# EAGLE design M113C (EAGLE 6.6.0)
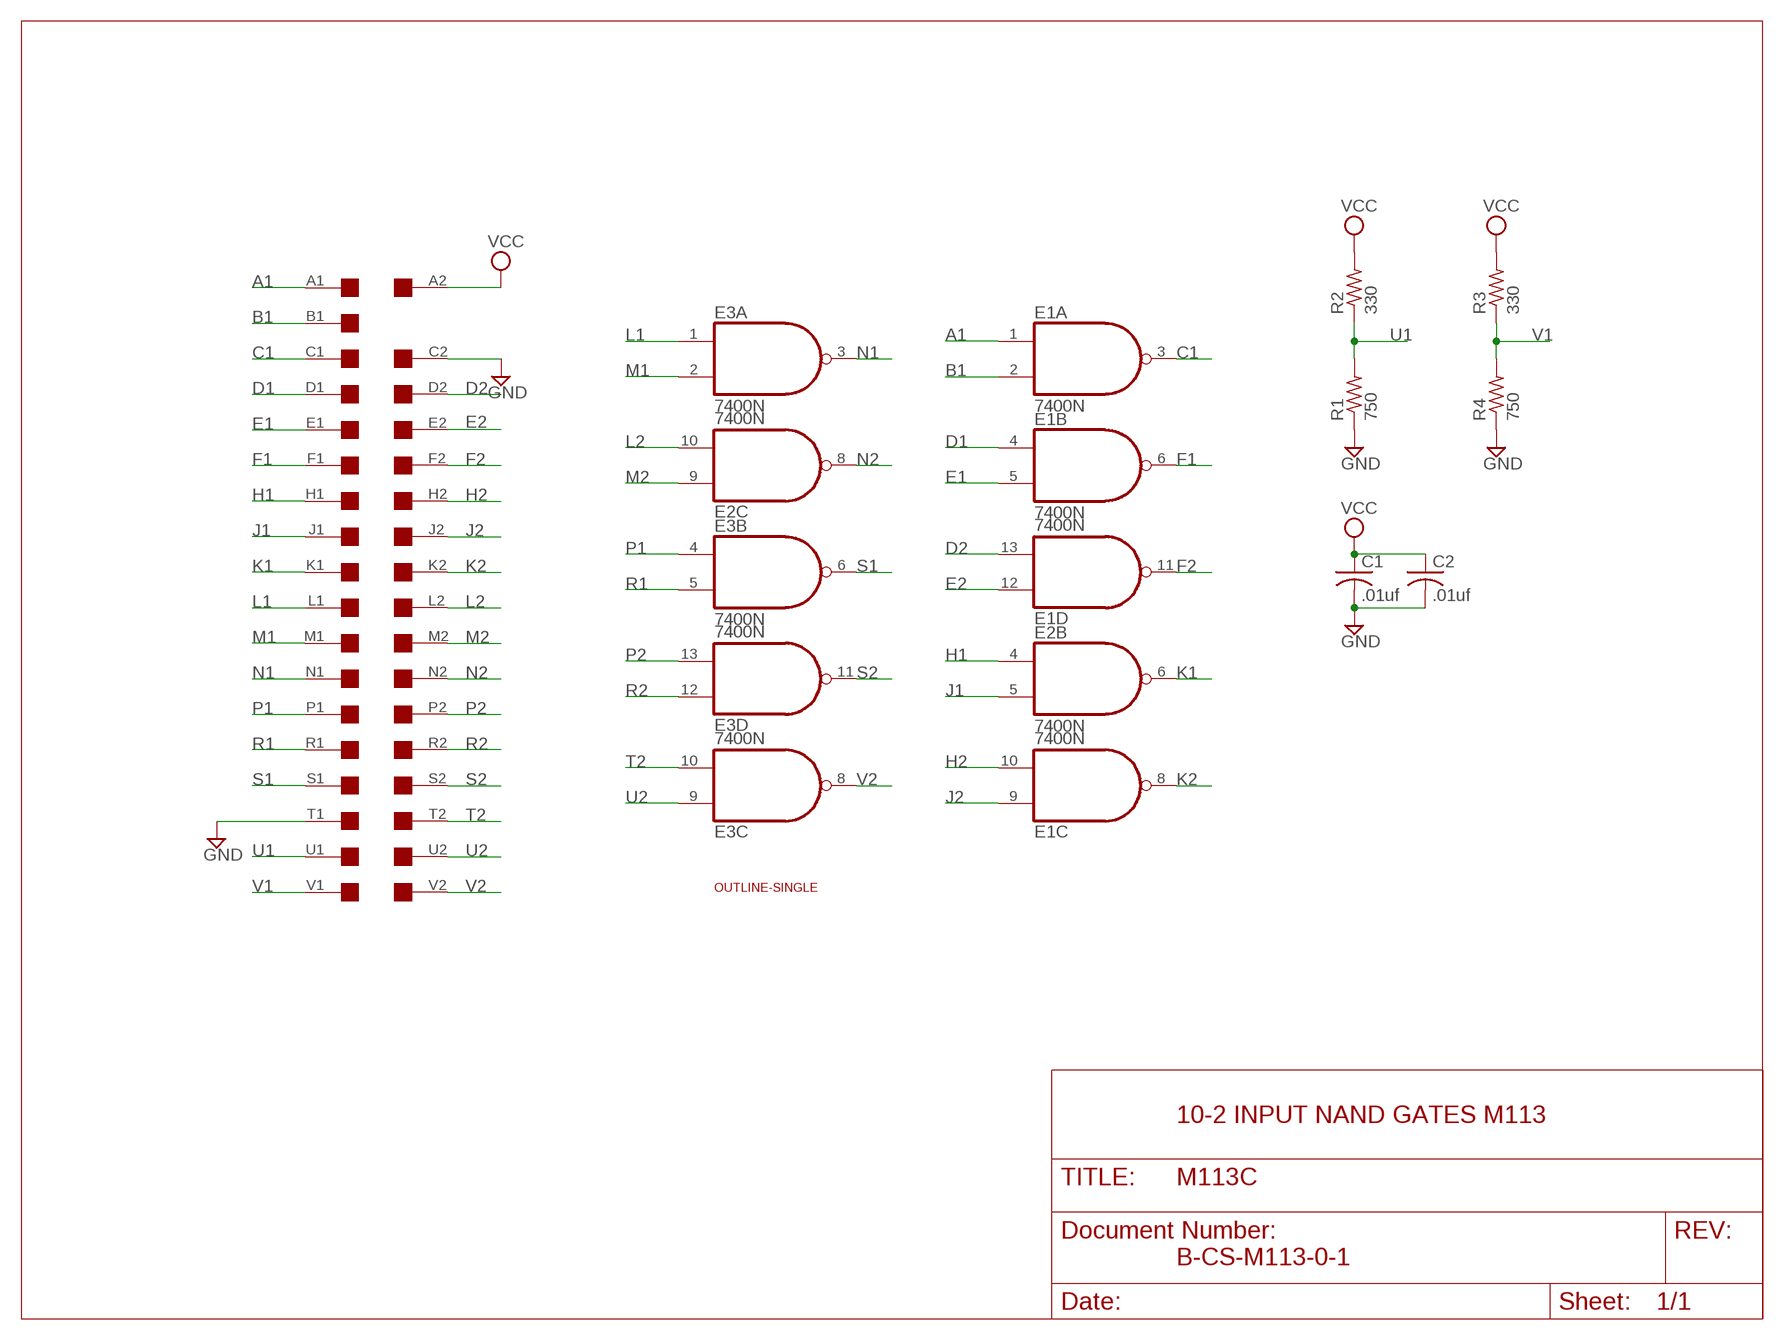
[diagram p0: schematic, sheet 1]

## Parts
C1  .01uf  C-US050-025X075  [C050-025X075]
C2  .01uf  C-US050-025X075  [C050-025X075]
E1  7400N  [DIL14]
E2  7400N  [DIL14]
E3  7400N  [DIL14]
R1  750  R-US_0207/10  [0207/10]
R2  330  R-US_0207/10  [0207/10]
R3  330  R-US_0207/10  [0207/10]
R4  750  R-US_0207/10  [0207/10]
U$1  SINGLE  [EDGE-CON2]
U$2  OUTLINE-SINGLE  [SINGLE]

## Nets
A1: E1.1(A:I0) U$1.A1
B1: E1.2(A:I1) U$1.B1
C1: E1.3(A:O) U$1.C1
D1: E1.4(B:I0) U$1.D1
D2: E1.13(D:I1) U$1.D2
E1: E1.5(B:I1) U$1.E1
E2: E1.12(D:I0) U$1.E2
F1: E1.6(B:O) U$1.F1
F2: E1.11(D:O) U$1.F2
GND [Supply]: C1.2 C2.2 R1.1 R4.1 U$1.C2 U$1.T1
H1: E2.4(B:I0) U$1.H1
H2: E1.10(C:I1) U$1.H2
J1: E2.5(B:I1) U$1.J1
J2: E1.9(C:I0) U$1.J2
K1: E2.6(B:O) U$1.K1
K2: E1.8(C:O) U$1.K2
L1: E3.1(A:I0) U$1.L1
L2: E2.10(C:I1) U$1.L2
M1: E3.2(A:I1) U$1.M1
M2: E2.9(C:I0) U$1.M2
N1: E3.3(A:O) U$1.N1
N2: E2.8(C:O) U$1.N2
P1: E3.4(B:I0) U$1.P1
P2: E3.13(D:I1) U$1.P2
R1: E3.5(B:I1) U$1.R1
R2: E3.12(D:I0) U$1.R2
S1: E3.6(B:O) U$1.S1
S2: E3.11(D:O) U$1.S2
T2: E3.10(C:I1) U$1.T2
U1: R1.2 R2.1 U$1.U1
U2: E3.9(C:I0) U$1.U2
V1: R3.1 R4.2 U$1.V1
V2: E3.8(C:O) U$1.V2
VCC [Supply]: C1.1 C2.1 R2.2 R3.2 U$1.A2
Unconnected: E2.1(A:I0) E2.2(A:I1) E2.3(A:O) E2.11(D:O) E2.12(D:I0) E2.13(D:I1) U$1.B2

## Notes on the sheet
- 10-2 INPUT NAND GATES M113
- B-CS-M113-0-1

## Power pins joined to a net without a drawn wire
GND: E1.7(P:GND) E2.7(P:GND) E3.7(P:GND)
VCC: E1.14(P:VCC) E2.14(P:VCC) E3.14(P:VCC)

## Library data of the parts
C1 C2 = rcl:C-US: CAPACITOR, American symbol
E1-E3 = 74xx-us:74*00: Quad 2-input NAND gate
R1-R4 = rcl:R-US_: RESISTOR, American symbol
U$1 = dec-con:SINGLE: Single-Height DEC board
U$2 = dec-con:OUTLINE-*: Board outlines for DEC boards.

## Net classes
1 Supply: width 0.813 mm

## Board
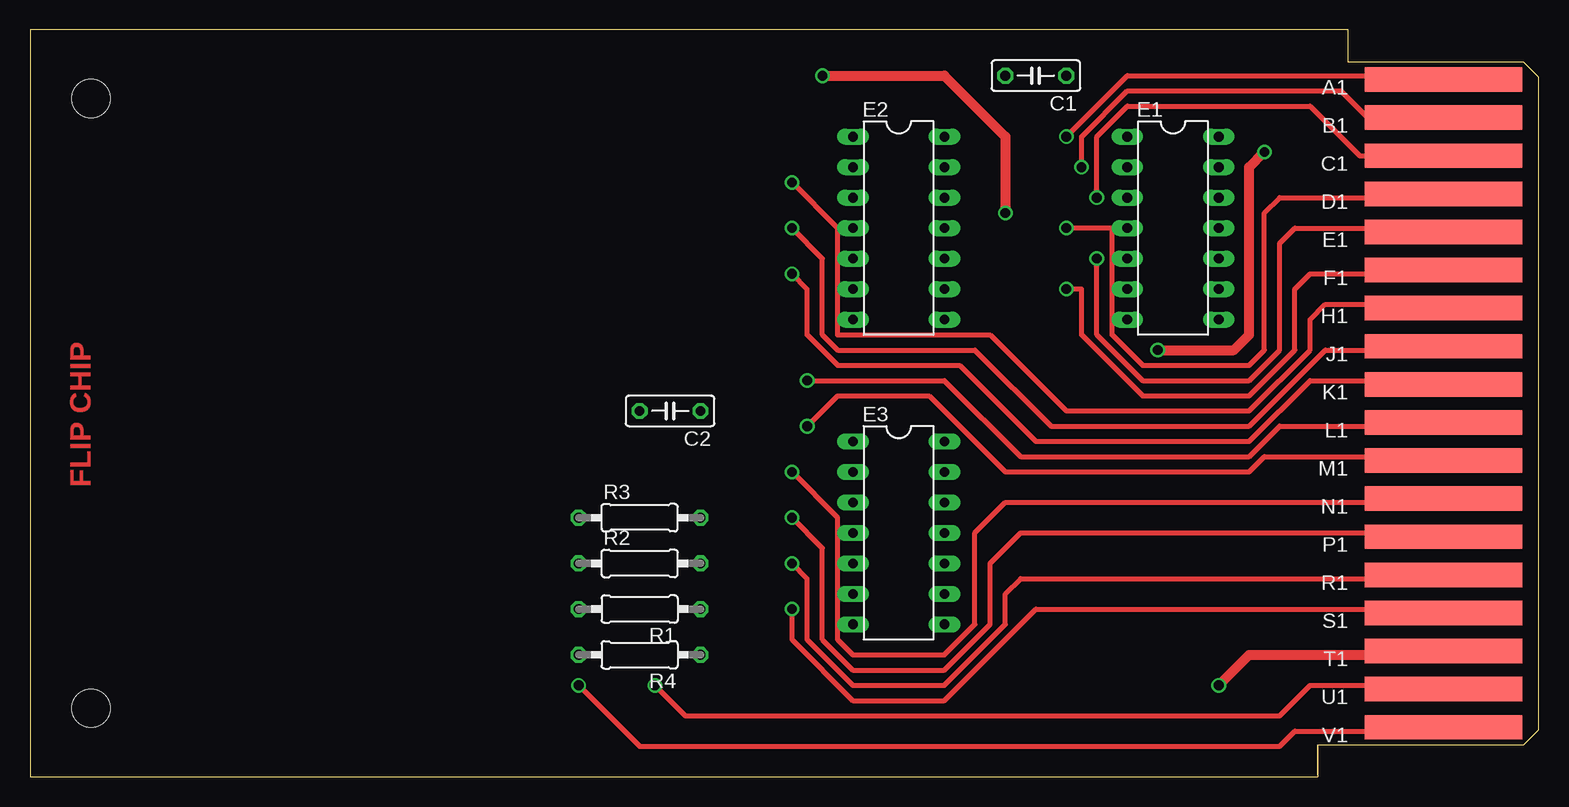
[diagram p1: board, top side]
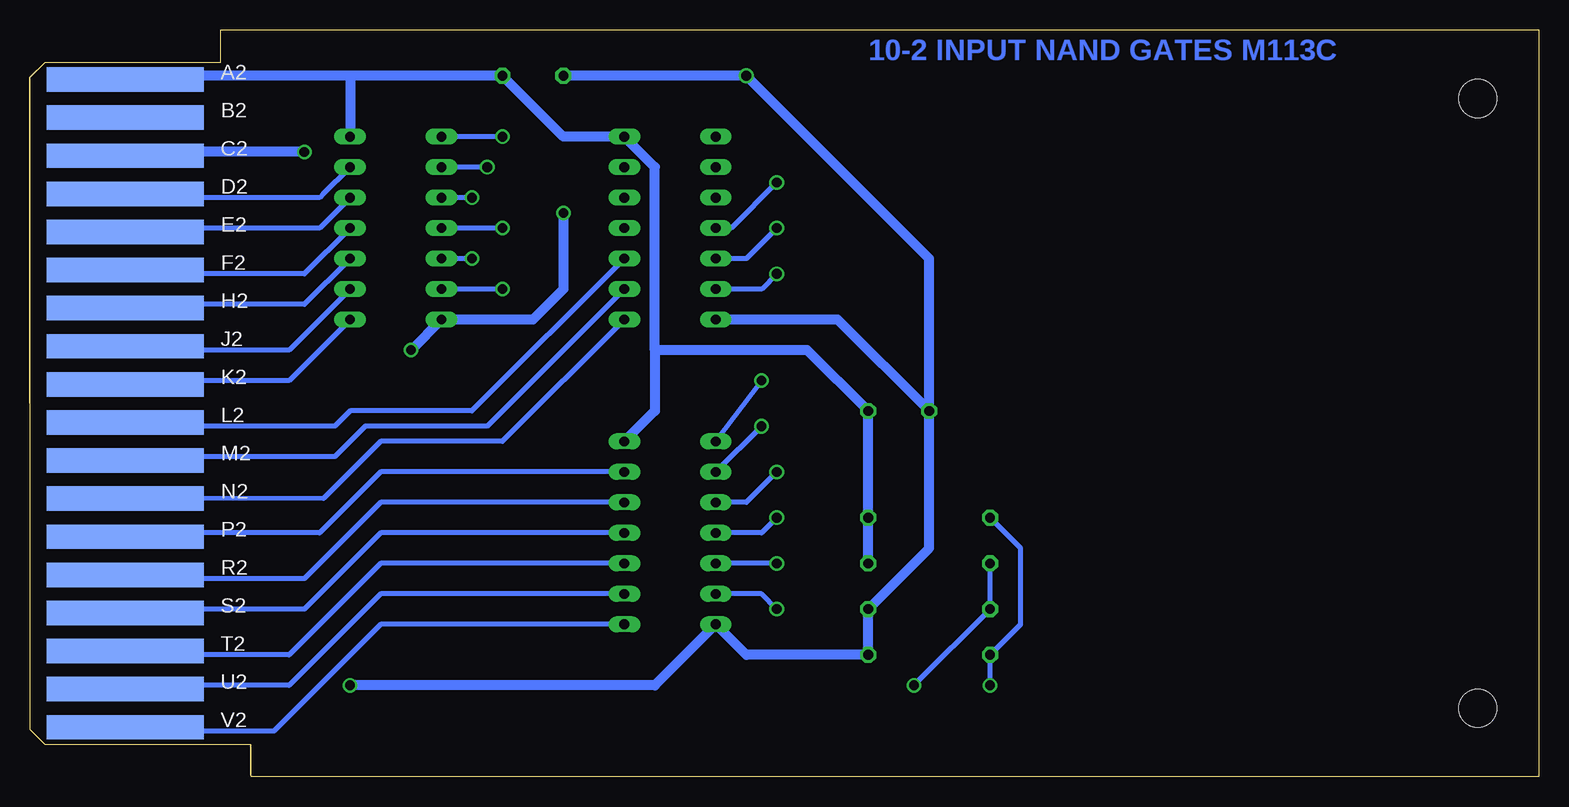
[diagram p2: board, bottom side, seen from below]

Size 125.73 x 62.23 mm. Coordinates in mm from the lower left corner, seen from the top.
Copper layers (1+16): Top 0.035mm / dielectric 1.5mm / Bottom 0.035mm
Design rules "16mils": minimum track width 16mil, minimum drill 32mil, track to track 15mil, track to pad 10mil, pad to pad 10mil, via to via 10mil, smd to smd 10mil, copper to edge 13mil, drill to drill 10mil, minimum pad ring 10mil, minimum via ring 8mil, stop-mask expansion 0mil, vias tented up to drill 0mil, thermal gap 10mil

### Footprints (pad centres in the part's own frame; a part is rotated, then mirrored left to right if it is on the bottom)
C050-025X075 = drill 0.813 octagon: 1 -2.54,0; 2 2.54,0
DIL14 = drill 0.813 long: 1 -7.62,-3.81; 2 -5.08,-3.81; 3 -2.54,-3.81; 4 0,-3.81; 5 2.54,-3.81; 6 5.08,-3.81; 7 7.62,-3.81; 8 7.62,3.81; 9 5.08,3.81; 10 2.54,3.81; 11 0,3.81; 12 -2.54,3.81; 13 -5.08,3.81; 14 -7.62,3.81
0207/10 = drill 0.813 octagon: 1 -5.08,0; 2 5.08,0
EDGE-CON2 = smd 13.106 x 2.032: A1 7.938,4.128; B1 7.938,7.303; C1 7.938,10.477; D1 7.938,13.652; E1 7.938,16.828; F1 7.938,20.003; H1 7.938,23.177; J1 7.938,26.352; K1 7.938,29.527; L1 7.938,32.703; M1 7.938,35.877; N1 7.938,39.053; P1 7.938,42.227; R1 7.938,45.403; S1 7.938,48.578; T1 7.938,51.752; U1 7.938,54.928; V1 7.938,58.102 | smd 13.106 x 2.032 bottom: A2 7.938,4.128; B2 7.938,7.303; C2 7.938,10.477; D2 7.938,13.652; E2 7.938,16.828; F2 7.938,20.003; H2 7.938,23.177; J2 7.938,26.352; K2 7.938,29.527; L2 7.938,32.703; M2 7.938,35.877; N2 7.938,39.053; P2 7.938,42.227; R2 7.938,45.403; S2 7.938,48.578; T2 7.938,51.752; U2 7.938,54.928; V2 7.938,58.102
SINGLE = hole 3.175: 120.65,56.515; 120.65,5.715

### Placement (x,y rotation side)
C1  83.82,58.42 180 top
C2  53.34,30.48 180 top
E1  95.25,45.72 270 top
E2  72.39,45.72 270 top
E3  72.39,20.32 270 top
R1  50.8,13.97 180 top
R2  50.8,17.78 0 top
R3  50.8,21.59 0 top
R4  50.8,10.16 180 top
U$1  125.73,62.23 180 top
U$2  125.73,62.23 180 top

### Tracks (layer width: path | path; a pad name or v marks a point on that pad's centre or on a via)
A1  (via drill 0.81)
  Top 0.406: U$1.A1 112.16,58.02 111.76,58.42 91.44,58.42 v86.36,53.34
  Bottom 0.406: v86.36,53.34 E1.1
B1  (via drill 0.81)
  Top 0.406: U$1.B1 112.74,54.9 111.76,54.61 109.22,57.15 91.44,57.15 87.63,53.34 v87.63,50.8
  Bottom 0.406: v87.63,50.8 E1.2
C1  (via drill 0.81)
  Top 0.406: U$1.C1 110.82,51.74 106.68,55.88 91.44,55.88 88.9,53.34 v88.9,48.26
  Bottom 0.406: v88.9,48.26 E1.3
D1  (via drill 0.81)
  Top 0.406: U$1.D1 112.06,48.56 111.76,48.26 104.14,48.26 102.87,46.99 102.87,35.56 101.6,34.29 92.71,34.29 90.17,36.83 90.17,45.72 v86.36,45.72
  Bottom 0.406: v86.36,45.72 E1.4
D2
  Bottom 0.406: U$1.D2 112.06,48.56 111.76,48.26 101.6,48.26 101.3,48.56 E1.13
E1  (via drill 0.81)
  Top 0.406: U$1.E1 112.09,45.39 111.76,45.72 105.41,45.72 104.14,44.45 104.14,35.56 101.6,33.02 92.71,33.02 88.9,36.83 v88.9,43.18
  Bottom 0.406: v88.9,43.18 E1.5
E2
  Bottom 0.406: U$1.E2 112.09,45.39 111.76,45.72 101.6,45.72 E1.12
F1  (via drill 0.81)
  Top 0.406: U$1.F1 112.04,42.19 111.76,41.91 106.68,41.91 105.41,40.64 105.41,35.56 101.6,31.75 92.71,31.75 87.63,36.83 87.63,40.64 v86.36,40.64
  Bottom 0.406: v86.36,40.64 E1.6
F2
  Bottom 0.406: U$1.F2 112.04,42.19 111.76,41.91 102.87,41.91 E1.11
GND  (via drill 0.81)
  Top 0.813: v102.87,52.07 101.6,50.8 101.6,36.83 100.33,35.56 v93.98,35.56 | v66.04,58.42 76.2,58.42 81.28,53.34 v81.28,46.99 | U$1.T1 112.09,10.49 111.76,10.16 101.6,10.16 v99.06,7.62
  Bottom 0.813: U$1.C2 112.09,51.74 111.76,52.07 v102.87,52.07 | v93.98,35.56 E1.7 83.82,38.1 81.28,40.64 v81.28,46.99 | C1.2 v66.04,58.42 50.8,43.18 C2.2 | C2.2 58.42,38.1 E2.7 | C2.2 50.8,19.05 R1.1 R4.1 66.04,10.16 E3.7 73.66,7.62 v99.06,7.62
H1  (via drill 0.81)
  Top 0.406: U$1.H1 112.09,39.04 111.76,39.37 107.95,39.37 106.68,38.1 106.68,35.56 101.6,30.48 86.36,30.48 80.01,36.83 67.31,36.83 67.31,45.72 v63.5,49.53
  Bottom 0.406: E2.4 67.31,45.72 v63.5,49.53
H2
  Bottom 0.406: U$1.H2 112.09,39.04 111.76,39.37 102.87,39.37 E1.10
J1  (via drill 0.81)
  Top 0.406: U$1.J1 112.09,35.89 111.76,35.56 107.95,35.56 101.6,29.21 85.09,29.21 78.74,35.56 67.31,35.56 66.04,36.83 66.04,43.18 v63.5,45.72
  Bottom 0.406: E2.5 66.04,43.18 v63.5,45.72
J2
  Bottom 0.406: U$1.J2 112.09,35.89 111.76,35.56 104.14,35.56 103.81,35.89 E1.9
K1  (via drill 0.81)
  Top 0.406: U$1.K1 112.06,32.72 111.76,33.02 106.68,33.02 101.6,27.94 83.82,27.94 77.47,34.29 67.31,34.29 64.77,36.83 64.77,40.64 v63.5,41.91
  Bottom 0.406: E2.6 64.77,40.64 v63.5,41.91
K2
  Bottom 0.406: U$1.K2 112.06,32.72 111.76,33.02 104.14,33.02 E1.8
L1  (via drill 0.81)
  Top 0.406: v64.77,33.02 76.2,33.02 82.55,26.67 101.6,26.67 104.14,29.21 111.76,29.21 112.09,29.54 U$1.L1
  Bottom 0.406: E3.1 v64.77,33.02
L2
  Bottom 0.406: E2.10 88.9,30.48 99.06,30.48 100.33,29.21 111.76,29.21 112.09,29.54 U$1.L2
M1  (via drill 0.81)
  Top 0.406: v64.77,29.21 67.31,31.75 74.93,31.75 81.28,25.4 101.6,25.4 102.87,26.67 111.76,26.67 112.09,26.34 U$1.M1
  Bottom 0.406: v64.77,29.21 E3.2
M2
  Bottom 0.406: E2.9 87.63,29.21 97.79,29.21 100.33,26.67 111.76,26.67 112.09,26.34 U$1.M2
N1  (via drill 0.81)
  Top 0.406: U$1.N1 112.09,23.19 111.76,22.86 81.28,22.86 78.74,20.32 78.74,12.7 76.2,10.16 68.58,10.16 67.31,11.43 67.31,21.59 v63.5,25.4
  Bottom 0.406: E3.3 66.04,22.86 v63.5,25.4
N2
  Bottom 0.406: U$1.N2 101.27,23.19 96.52,27.94 86.36,27.94 E2.8
P1  (via drill 0.81)
  Top 0.406: U$1.P1 112.09,19.99 111.76,20.32 82.55,20.32 80.01,17.78 80.01,12.7 76.2,8.89 68.58,8.89 66.04,11.43 66.04,19.05 v63.5,21.59
  Bottom 0.406: E3.4 64.77,20.32 v63.5,21.59
P2
  Bottom 0.406: U$1.P2 112.09,19.99 111.76,20.32 101.6,20.32 96.52,25.4 E3.13
R1  (via drill 0.81)
  Top 0.406: U$1.R1 112.09,16.84 111.76,16.51 82.55,16.51 81.28,15.24 81.28,12.7 76.2,7.62 68.58,7.62 64.77,11.43 64.77,16.51 v63.5,17.78
  Bottom 0.406: v63.5,17.78 E3.5
R2
  Bottom 0.406: U$1.R2 112.09,16.84 111.76,16.51 102.87,16.51 96.52,22.86 E3.12
S1  (via drill 0.81)
  Top 0.406: U$1.S1 112.06,13.66 111.76,13.97 83.82,13.97 76.2,6.35 68.58,6.35 63.5,11.43 v63.5,13.97
  Bottom 0.406: E3.6 64.77,15.24 v63.5,13.97
S2
  Bottom 0.406: U$1.S2 112.06,13.66 111.76,13.97 102.87,13.97 96.52,20.32 E3.11
T2
  Bottom 0.406: U$1.T2 112.09,10.49 111.76,10.16 104.14,10.16 96.52,17.78 E3.10
U1  (via drill 0.81)
  Top 0.406: v52.07,7.62 54.61,5.08 104.14,5.08 106.68,7.62 111.76,7.62 112.12,7.26 U$1.U1
  Bottom 0.406: R2.1 R1.2 v52.07,7.62
U2
  Bottom 0.406: U$1.U2 112.12,7.26 111.76,7.62 104.14,7.62 96.52,15.24 E3.9
V1  (via drill 0.81)
  Top 0.406: U$1.V1 112.15,4.2 111.76,3.81 105.41,3.81 104.14,2.54 50.8,2.54 v45.72,7.62
  Bottom 0.406: v45.72,7.62 R4.2 43.18,12.7 43.18,19.05 R3.1
V2
  Bottom 0.406: U$1.V2 112.64,4.2 111.76,3.81 105.41,3.81 96.52,12.7 E3.8
VCC
  Bottom 0.813: U$1.A2 112.16,58.02 111.76,58.42 99.06,58.42 | 99.06,58.42 E1.14 | 99.06,58.42 C1.1 81.28,53.34 E2.14 73.66,50.8 73.66,35.56 | R2.2 R3.2 C2.1 60.96,35.56 73.66,35.56 | E3.14 73.66,30.48 73.66,35.56

### Text on the board
Top: FLIP CHIP
Bottom: 10-2 INPUT NAND GATES M113C